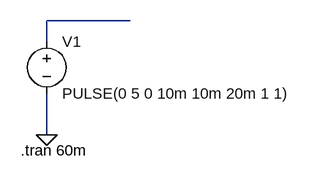
[diagram p0: schematic Draft2.asc]
Draft2.asc, the LTspice schematic file:
Version 4.1
SHEET 1 880 680
WIRE 176 208 48 208
WIRE 48 240 48 208
WIRE 48 384 48 320
FLAG 48 384 0
SYMBOL voltage 48 224 R0
WINDOW 123 0 0 Left 0
WINDOW 39 0 0 Left 0
SYMATTR InstName V1
SYMATTR Value PULSE(0 5 0 10m 10m 20m 1 1)
TEXT 8 408 Left 2 !.tran 60m

The netlist it stands for:
* Draft2.asc
V1 N001 0 PULSE(0 5 0 10m 10m 20m 1 1)
.tran 60m
.backanno
.end